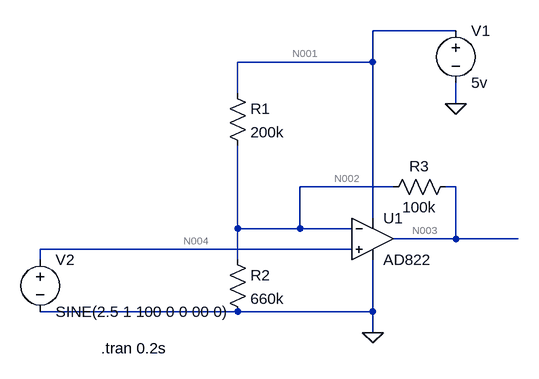
[diagram p0: schematic AmpInput.asc]
AmpInput.asc, the LTspice schematic file:
Version 4
SHEET 1 880 680
WIRE 352 -144 224 -144
WIRE 224 -96 224 -144
WIRE 224 -96 16 -96
WIRE 16 -48 16 -96
WIRE 352 -32 352 -64
WIRE 256 96 112 96
WIRE 352 96 336 96
WIRE 224 144 224 -96
WIRE 16 160 16 32
WIRE 112 160 112 96
WIRE 112 160 16 160
WIRE 192 160 112 160
WIRE 352 176 352 96
WIRE 352 176 256 176
WIRE 448 176 352 176
WIRE 192 192 -288 192
WIRE -288 208 -288 192
WIRE 16 208 16 160
WIRE 16 288 -288 288
WIRE 224 288 224 208
WIRE 224 288 16 288
WIRE 224 320 224 288
FLAG 224 320 0
FLAG 352 -32 0
SYMBOL Opamps\\AD822 224 112 R0
SYMATTR InstName U1
SYMBOL res 0 -64 R0
SYMATTR InstName R1
SYMATTR Value 200k
SYMBOL res 0 192 R0
SYMATTR InstName R2
SYMATTR Value 660k
SYMBOL res 352 80 R90
WINDOW 0 0 56 VBottom 2
WINDOW 3 32 56 VTop 2
SYMATTR InstName R3
SYMATTR Value 100k
SYMBOL voltage 352 -160 R0
WINDOW 123 0 0 Left 0
WINDOW 39 0 0 Left 0
SYMATTR InstName V1
SYMATTR Value 5v
SYMBOL voltage -288 192 R0
WINDOW 123 0 0 Left 0
WINDOW 39 0 0 Left 0
SYMATTR InstName V2
SYMATTR Value SINE(2.5 1 100 0 0 00 0)
TEXT -194 344 Left 2 !.tran 0.2s

The netlist it stands for:
* AmpInput.asc
XU1 N004 N002 N001 0 N003 AD822  ; pins In+ In- V+ V- OUT
R1 N001 N002 200k
R2 N002 0 660k
R3 N003 N002 100k
V1 N001 0 5v
V2 N004 0 SINE(2.5 1 100 0 0 00 0)
.tran 0.2s
.backanno
.end

* Results of the author's LTspice run, read from the files saved beside the schematic
* Operating Point, zero values left out:
*   V(n001) = 5 V
*   V(n004) = 2.5 V
*   V(n002) = 2.5 V
*   V(n003) = 1.629 V
*   I(R3) = -8.711 µA
*   I(R2) = 3.788 µA
*   I(R1) = 12.5 µA
*   I(V2) = 3.5 pA
*   I(V1) = -602.6 µA
*   Ix(u1:1) = -3.5 pA
*   Ix(u1:2) = -5.5 pA
*   Ix(u1:99) = 590.1 µA
*   Ix(u1:50) = -598.8 µA
*   Ix(u1:25) = 8.711 µA
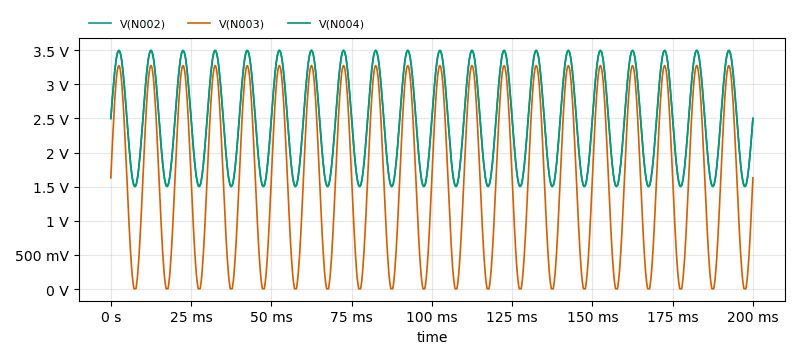
[diagram p1: Transient Analysis of AmpInput.asc, plotted from the saved traces]
* Transient Analysis, 1 run:
*   V(N002): min 1.516 V, max 3.497 V, average 2.5 V, rms 2.598 V, last 2.5 V
*   V(N003): min 4.178 mV, max 3.276 V, average 1.629 V, rms 2.005 V, last 1.629 V
*   V(N004): min 1.5 V, max 3.497 V, average 2.5 V, rms 2.598 V, last 2.5 V